# Altium project DAN_RF_ESP.PrjPcb
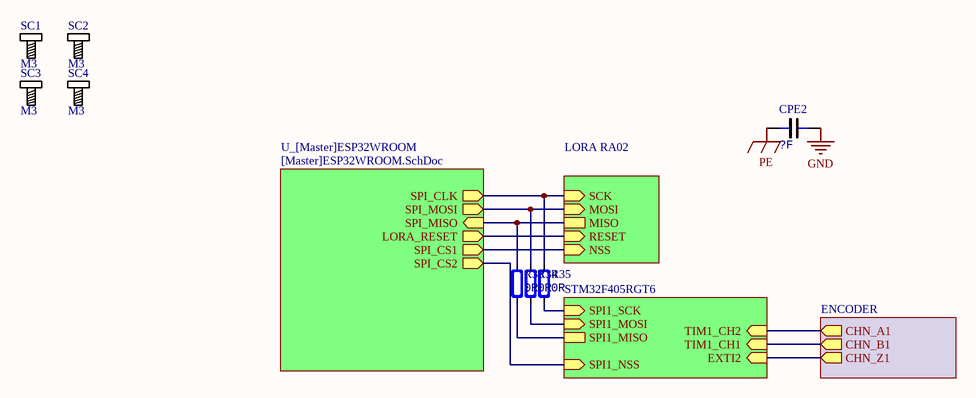
[diagram p0: TOPLEVEL.SchDoc]
5 sheets, 89 parts. Net scope: hierarchical (ports join the sheet entries above them; power ports are global).
Board file: DAN_ENCODER.PcbDoc
Sheets:
  TOPLEVEL.SchDoc
    U_[Master]ESP32WROOM = [Master]ESP32WROOM.SchDoc
    LORA RA02 = [Slave]SX1278.SchDoc
    STM32F405RGT6 = [Slave]STM32F405RGT6.SchDoc
    ENCODER = [Module]ReadSingleEncoderABZ.SchDoc

## Sheet TOPLEVEL.SchDoc: AC
size A4; Author: Nguyen Huu Nghia; CompanyName: MAT; Organization: AD20; Address1: x; Address2: x; Address3: x; Address4: x; DocumentNumber: 1; Revision: V1.0; SheetNumber: 1; SheetTotal: 1

### Parts
CPE2  value ?F  [CN3]  (hidden comment: Cap_PE)
R33  value 0R  [RES-1/4W]  (hidden comment: Resistor)
R34  value 0R  [RES-1/4W]  (hidden comment: Resistor)
R35  value 0R  [RES-1/4W]  (hidden comment: Resistor)
SC1  M3  [SCRREW_M3]
SC2  M3  [SCRREW_M3]
SC3  M3  [SCRREW_M3]
SC4  M3  [SCRREW_M3]

### Sub-sheets
ENCODER = [Module]ReadSingleEncoderABZ.SchDoc: CHN_A1 (out), CHN_B1 (out), CHN_Z1 (out)
LORA RA02 = [Slave]SX1278.SchDoc: NSS (in), SCK (in), MOSI (in), RESET (in), MISO
STM32F405RGT6 = [Slave]STM32F405RGT6.SchDoc: TIM1_CH2 (in), TIM1_CH1 (in), EXTI2 (in), SPI1_NSS (in), SPI1_SCK (in), SPI1_MOSI (in), SPI1_MISO
U_[Master]ESP32WROOM = [Master]ESP32WROOM.SchDoc: LORA_RESET (out), SPI_MOSI (out), SPI_CLK (out), SPI_MISO (in), SPI_CS2 (out), SPI_CS1 (out)

### Nets
GND: CPE2.2
PE: CPE2.1
CHN_A1: sheet STM32F405RGT6/TIM1_CH2, sheet ENCODER/CHN_A1
CHN_B1: sheet STM32F405RGT6/TIM1_CH1, sheet ENCODER/CHN_B1
CHN_Z1: sheet STM32F405RGT6/EXTI2, sheet ENCODER/CHN_Z1
LORA_RESET: sheet U_[Master]ESP32WROOM/LORA_RESET, sheet LORA RA02/RESET
MISO: R33.2 ; sheet U_[Master]ESP32WROOM/SPI_MISO, sheet LORA RA02/MISO
MOSI: R34.2 ; sheet U_[Master]ESP32WROOM/SPI_MOSI, sheet LORA RA02/MOSI
NSS: sheet U_[Master]ESP32WROOM/SPI_CS1, sheet LORA RA02/NSS
SCK: R35.2 ; sheet U_[Master]ESP32WROOM/SPI_CLK, sheet LORA RA02/SCK
SPI1_MISO: R33.1 ; sheet STM32F405RGT6/SPI1_MISO
SPI1_MOSI: R34.1 ; sheet STM32F405RGT6/SPI1_MOSI
SPI1_NSS: sheet U_[Master]ESP32WROOM/SPI_CS2, sheet STM32F405RGT6/SPI1_NSS
SPI1_SCK: R35.1 ; sheet STM32F405RGT6/SPI1_SCK

### Notes on the sheet
- Title
- Size:
- Date:
- A4
- Number:
- Time:
- Revision:
- Sheet
- of
- File:

### Library data of the parts
CPE2 = Cap_PE: Capacitor; Manufacturer: *; Note: *
R33-R35 = Resistor: SMD Resistor; Specification: ±1%; Manufacturer: *; Note: *
SC1-SC4 = Screw_M3: Screw

## Sheet [Master]ESP32WROOM.SchDoc: AC
size A4; Author: Nguyen Huu Nghia; CompanyName: MAT; Organization: AD20; Address1: x; Address2: x; Address3: x; Address4: x; DocumentNumber: 1; Revision: V1.0; SheetNumber: 1; SheetTotal: 1
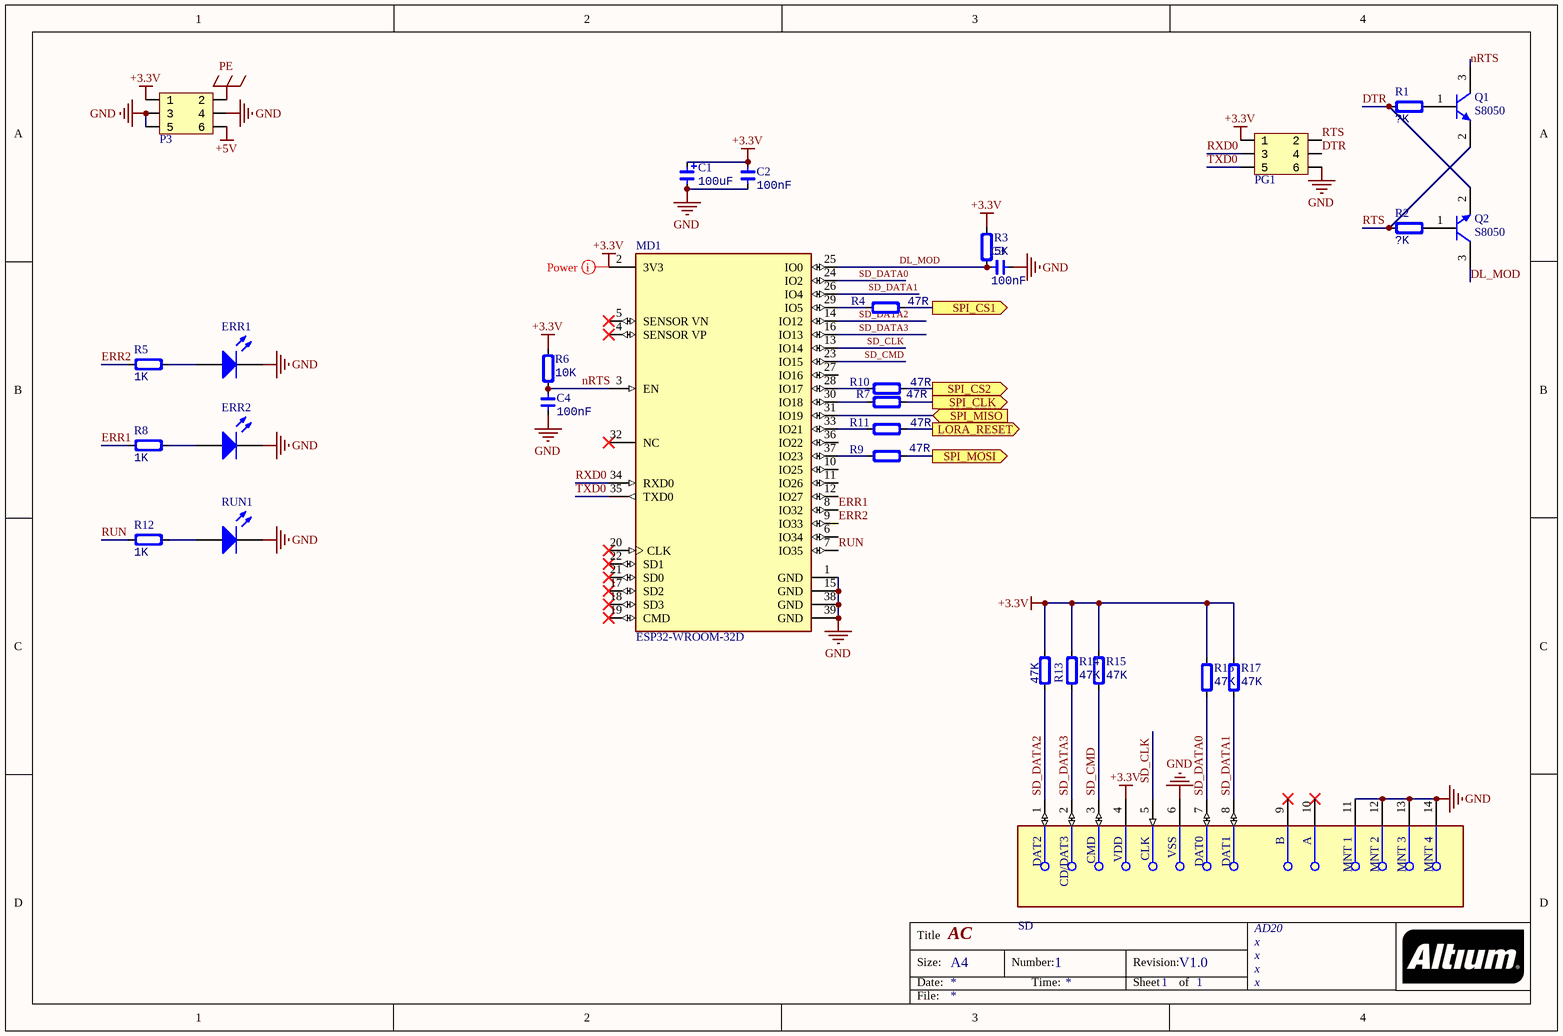
[diagram p1: [Master]ESP32WROOM.SchDoc]

### Parts
C1  value 100uF  [CAP_TAN_1206]  (hidden comment: C1206)
C2  value 100nF  [CAP-0805]  (hidden comment: Cap_0805)
C3  value 100nF  [CAP-0603]  (hidden comment: Cap_0603)
C4  value 100nF  [CAP-0603]  (hidden comment: Cap_0603)
ERR1  150080YS75000  [0805_A]  (value not drawn)
ERR2  150080YS75000  [0805_A]  (value not drawn)
MD1  ESP32-WROOM-32D  [FP-ESP32-WROOM-32D-MFG]
P3  HDR2x3  [HDR2X3_2.54_90F]  (value not drawn)
PG1  HDR2x3  [HDR2X3_2.54_90F]  (value not drawn)
Q1  S8050  [ONSC-SOT-23-3-318-08_V]
Q2  S8050  [ONSC-SOT-23-3-318-08_V]
R1  value ?K  [RES-0805]  (hidden comment: R0805)
R2  value ?K  [RES-0805]  (hidden comment: R0805)
R3  value 5K  [RES-0805]  (hidden comment: R0805)
R4  value 47R  [RES-0805]  (hidden comment: R0805)
R5  value 1K  [RES-0805]  (hidden comment: R0805)
R6  value 10K  [RES-0805]  (hidden comment: R0805)
R7  value 47R  [RES-0805]  (hidden comment: R0805)
R8  value 1K  [RES-0805]  (hidden comment: R0805)
R9  value 47R  [RES-0805]  (hidden comment: R0805)
R10  value 47R  [RES-0805]  (hidden comment: R0805)
R11  value 47R  [RES-0805]  (hidden comment: R0805)
R12  value 1K  [RES-0805]  (hidden comment: R0805)
R13  value 47K  [RES-0805]  (hidden comment: R0805)
R14  value 47K  [RES-0805]  (hidden comment: R0805)
R15  value 47K  [RES-0805]  (hidden comment: R0805)
R16  value 47K  [RES-0805]  (hidden comment: R0805)
R17  value 47K  [RES-0805]  (hidden comment: R0805)
RUN1  150080YS75000  [0805_A]  (value not drawn)
SD  DM3AT-SF-PEJM5(11)  [FP-DM3AT-SF-PEJM5_11-MFG]  (value not drawn)

### Ports
LORA_RESET (out), SPI_CLK (out), SPI_CS1 (out), SPI_CS2 (out), SPI_MISO (in), SPI_MOSI (out)

### Nets
+3.3V: C1.1 C2.2 MD1.2(3V3) P3.1 PG1.1 R3.1 R6.1 R13.1 R14.1 R15.1 R16.1 R17.1 SD.4(VDD)
+5V: P3.6
GND: C1.2 C2.1 C3.1 C4.1 ERR1.1(K) ERR2.1(K) MD1.1(GND) MD1.15(GND) MD1.38(GND) MD1.39(GND) P3.3 P3.4 P3.5 PG1.6 RUN1.1(K) SD.6(VSS) SD.11(MNT_1) SD.12(MNT_2) SD.13(MNT_3) SD.14(MNT_4)
PE: P3.2
DL_MOD: C3.2 MD1.25(IO0) Q2.3(C) R3.2
DTR: PG1.4 Q2.2(E) R1.1
ERR1: MD1.8(IO32) R8.2
ERR2: MD1.9(IO33) R5.2
LORA_RESET: R11.2 ; port LORA_RESET
MISO: MD1.31(IO19) ; port SPI_MISO
MOSI: R9.2 ; port SPI_MOSI
nRTS: C4.2 MD1.3(EN) Q1.3(C) R6.2
NSS: R4.2 ; port SPI_CS1
RTS: PG1.2 Q1.2(E) R2.1
RUN: MD1.7(IO35) R12.2
RXD0: MD1.34(RXD0) PG1.3
SCK: R7.2 ; port SPI_CLK
SD_CLK: MD1.13(IO14) SD.5(CLK)
SD_CMD: MD1.23(IO15) R15.2 SD.3(CMD)
SD_DATA0: MD1.24(IO2) R16.2 SD.7(DAT0)
SD_DATA1: MD1.26(IO4) R17.2 SD.8(DAT1)
SD_DATA2: MD1.14(IO12) R13.2 SD.1(DAT2)
SD_DATA3: MD1.16(IO13) R14.2 SD.2(CD/DAT3)
SPI1_NSS: R10.2 ; port SPI_CS2
TXD0: MD1.35(TXD0) PG1.5
NetERR1_2: ERR1.2(A) R5.1
NetERR2_2: ERR2.2(A) R8.1
NetMD1_28: MD1.28(IO17) R10.1
NetMD1_29: MD1.29(IO5) R4.1
NetMD1_30: MD1.30(IO18) R7.1
NetMD1_33: MD1.33(IO21) R11.1
NetMD1_37: MD1.37(IO23) R9.1
NetQ1_1: Q1.1(B) R1.2
NetQ2_1: Q2.1(B) R2.2
NetR12_1: R12.1 RUN1.2(A)

Not connected (* = marked no-connect by the designer): MD1 4(SENSOR_VP)* 5(SENSOR_VN)* 6(IO34) 10(IO25) 11(IO26) 12(IO27) 17(SD2)* 18(SD3)* 19(CMD)* 20(CLK)* 21(SD0)* 22(SD1)* 27(IO16) 32(NC)* 36(IO22); SD 9(B)* 10(A)*

### Layout directives
mark named Power: +3.3V

### Notes on the sheet
- Title
- Size:
- Date:
- A4
- Number:
- Time:
- Revision:
- Sheet
- of
- File:

### Library data of the parts
C1 = Cap_Tan_1206: Capacitor Tantalum; Manufacturer: *; Note: *
C2 = Cap_0805: Capacitor; Manufacturer: *
C3 C4 = Cap_0603: Capacitor; Manufacturer: *
ERR1 ERR2 RUN1 = CMP-1426-00012-1: SMD mono-color Chip LED, WL-SMCW, Yellow; Manufacturer: Wuerth Elektronik; Color: Yellow; ComponentLink1URL: http://www.we-online.com; PackageReference: 0805_A; ComponentLink2URL: http://katalog.we-online.com/led/datasheet/150080YS75000.pdf; ComponentLink1Description: Manufacturer URL; ComponentLink2Description: Datasheet; PartNumber: 150080YS75000
MD1 = CMP-194065-000003-1: WIFI MODULE 32MBITS SPI FLASH; Manufacturer: Espressif Systems; Max Supply Voltage: 3.6V; Nominal Supply Current: 500mA; Max Frequency: 2484MHz; Number Of Adc Channels: 16; Number Of Gpio: 32; Interface: I2C,SPI,UART,Ethernet,I2S,Other; Data Rate: 150Mbits/s; Min Supply Voltage: 3V; Bandwidth: 72MHz; Sensitivity: -98dBm; Octopart: https://octopart.com/esp32-wroom-32d-espressif+systems-91040050; Package: ESP32-WROOM-32D; ComponentLink2URL: https://www.espressif.com/sites/default/files/documentation/esp32-wroom-32d_esp32-wroom-32u_datasheet_en.pdf; Lead Free: Yes; Category: UNK; Mouser Description: Wi-Fi/BT BLE Module ESP32-D0WD, SPI Flash, UART, P; Device Class L1: Integrated Circuits (ICs); RoHS: TRUE; Temperature Range Low: -40°C; ComponentLink2Description: Datasheet; Digikey Description: WIFI MODULE 32MBITS SPI FLASH; Height: 3.2mm; Temperature: -40°C to +85°C; Manufacturer Part Number: ESP32-WROOM-32D; Device Class L3: Transceivers; Device Class L2: RF Semiconductors and Devices; Temperature Range High: +85°C; Automotive: No
P3 PG1 = HDR2x3_2.54: Header
Q1 Q2 = CMP-1048-00662-1: High Voltage Transistor, NPN Silicon, 3-Pin SOT-23, Pb-Free, Tape and Reel; PartNumber: MMBTA42LT1G; Manufacturer: On Semiconductor; fT Min (MHz): 50; IC Continuous (A): 0.5; ComponentLink1URL: http://www.onsemi.com/; ComponentLink3URL: http://www.onsemi.cn/pub_link/Collateral/318-08.PDF; RoHS: TRUE; ComponentLink2Description: Datasheet; Polarity: NPN; DatasheetVersion: Rev. 12; PackageReference: SOT-23-3-318-08; PackageDescription: 3-Pin Small Outline Transistor, Body 2.92 x 1.3 mm, Pitch 0.95 mm; ComponentLink3Description: Package Specification; ComponentLink1Description: Manufacturer URL; Packing: Tape and Reel; PackageVersion: Rev. AP, 11/2009; Mounting Technology: Surface Mount; ComponentLink2URL: http://www.onsemi.cn/pub_link/Collateral/MMBTA42LT1-D.PDF
R1-R17 = Res_0805: Resistor; Manufacturer: *
SD = MicroSDCARD: CONN MICRO SD R/A PUSH-PUSH SMD; Manufacturer: Hirose; Number Of Contacts: 8; Current Rating: 0.5A; Shielding: true; Conn Orientation: Right Angle; Voltage Rating: 125V; Is Female: yes; Pitch: 1.1mm; Footprint Url: https://www.hirose.com/product/document?clcode=CL0609-0031-0-00&productname=DM3AT-SF-PEJM5&series=DM3&documenttype=2DDrawing&lang=en&documentid=0000947170; Temperature: -25°C to +85°C; Device Class L2: Memory Connectors; Device Class L1: Connectors; Device Class L3: unset; Temperature Range High: +85°C; Package: 0; Contact Material: Gold; Automotive: No; Mouser Description: Memory Card Connectors 8P R/A SMT MICRO SD PUSH-PUSH; Category: Conn; ComponentLink2URL: https://www.hirose.com/product/document?clcode=CL0609-0033-6-00&productname=DM3AT-SF-PEJ2M5&series=DM3&documenttype=Catalog&lang=en&documentid=D49662_en; Temperature Range Low: -25°C; RoHS: TRUE; ComponentLink2Description: Datasheet; Manufacturer Part Number: DM3AT-SF-PEJM5(11); Height: 1.83mm; Digikey Description: CONN MICRO SD R/A PUSH-PUSH SMD; Lead Free: Yes; Octopart: https://octopart.com/dm3at-sf-pejm5%2811%29-hirose-29719365

## Sheet [Slave]SX1278.SchDoc: AC
size A4; Author: Nguyen Huu Nghia; CompanyName: MAT; Organization: AD20; Address1: x; Address2: x; Address3: x; Address4: x; DocumentNumber: 1; Revision: V1.0; SheetNumber: 1; SheetTotal: 1
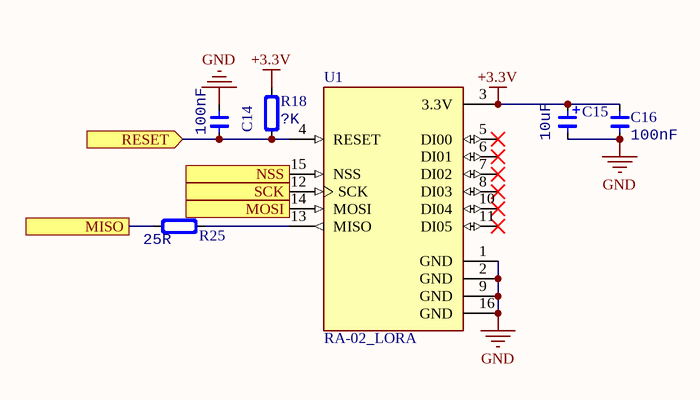
[diagram p2: [Slave]SX1278.SchDoc]

### Parts
C14  value 100nF  [CAP-0603]  (hidden comment: Cap_0603)
C15  value 10uF  [CAP_TAN_1206]  (hidden comment: C1206)
C16  value 100nF  [CAP-0603]  (hidden comment: Cap_0603)
R18  value ?K  [RES-0805]  (hidden comment: R0805)
R25  value 25R  [RES-0805]  (hidden comment: Res_0805)
U1  RA-02_LORA  [MODULE_RA-02_LORA]

### Ports
MISO, MOSI (in), NSS (in), RESET (in), SCK (in)

### Nets
+3.3V: C15.1 C16.2 R18.2 U1.3(3.3V)
GND: C14.1 C15.2 C16.1 U1.1(GND) U1.2(GND) U1.9(GND) U1.16(GND)
LORA_RESET: C14.2 R18.1 U1.4(RESET) ; port RESET
MISO: R25.1 ; port MISO
MOSI: U1.14(MOSI) ; port MOSI
NSS: U1.15(NSS) ; port NSS
SCK: U1.12(SCK) ; port SCK
NetR25_2: R25.2 U1.13(MISO)

Not connected (* = marked no-connect by the designer): U1 5(DI00)* 6(DI01)* 7(DI02)* 8(DI03)* 10(DI04)* 11(DI05)*

### Notes on the sheet
- Title
- Size:
- Date:
- A4
- Number:
- Time:
- Revision:
- Sheet
- of
- File:

### Library data of the parts
C14 C16 = Cap_0603: Capacitor; Manufacturer: *; Note: *
C15 = Cap_Tan_1206: Capacitor Tantalum; Manufacturer: *; Note: *
R18 = Res_0805: Resistor; Manufacturer: *; Note: *
R25 = Res_0805: Resistor; Specification: ±1%; Manufacturer: *; Note: *
U1 = RA-02_LORA: Ra-02 LoRa RF M5Stack Platform Evaluation Expansion Board; MF: AI-Thinker; Package: Package; Availability: Unavailable; Value: *; MP: Ra-02 LoRa; Check_prices: https://www.snapeda.com/parts/Ra-02%20LoRa/AI-Thinker/view-part/4449259/?ref=eda; SnapEDA_Link: https://www.snapeda.com/parts/Ra-02%20LoRa/AI-Thinker/view-part/4449259/?ref=snap; Price: None

## Sheet [Slave]STM32F405RGT6.SchDoc: AC
size A4; Author: Nguyen Huu Nghia; CompanyName: MAT; Organization: AD20; Address1: x; Address2: x; Address3: x; Address4: x; DocumentNumber: 1; Revision: V1.0; SheetNumber: 1; SheetTotal: 1
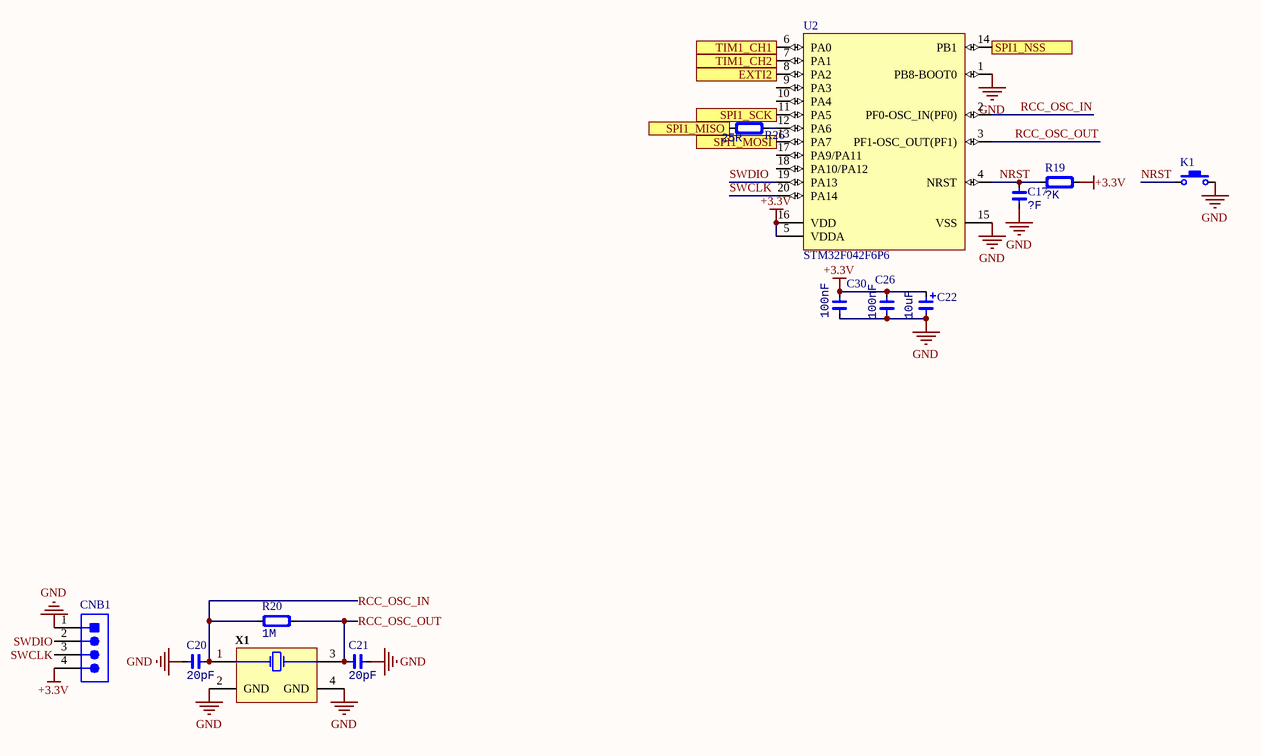
[diagram p3: [Slave]STM32F405RGT6.SchDoc]

### Parts
C17  value ?F  [CAP-0603]  (hidden comment: Cap_0603)
C20  value 20pF  [CAP-0603]  (hidden comment: Cap_0603)
C21  value 20pF  [CAP-0603]  (hidden comment: Cap_0603)
C22  value 10uF  [CAP_TAN_1206]  (hidden comment: C1206)
C26  value 100nF  [CAP-0603]  (hidden comment: Cap_0603)
C30  value 100nF  [CAP-0603]  (hidden comment: Cap_0603)
CNB1  B4B-EH-A(LF)(SN)  [JST-B4B-EH-A_V]  (value not drawn)
K1  TACT  [ButtonTACT_3x4x2_180]  (value not drawn)
R19  value ?K  [RES-0603]  (hidden comment: R0603)
R20  value 1M  [RES-0603]  (hidden comment: Res_0603)
R26  value 25R  [RES-0805]  (hidden comment: Res_0805)
U2  STM32F042F6P6  [STM-TSSOP20_M]
X1  7B-12.288MAAJ-T  [TXC-7B-4_V]  (value not drawn)

### Ports
EXTI2 (in), SPI1_MISO, SPI1_MOSI (in), SPI1_NSS (in), SPI1_SCK (in), TIM1_CH1 (in), TIM1_CH2 (in)

### Nets
+3.3V: C22.1 C26.2 C30.2 CNB1.4 R19.2 U2.5(VDDA) U2.16(VDD)
GND: C17.1 C20.2 C21.1 C22.2 C26.1 C30.1 CNB1.1 K1.2 U2.1(PB8-BOOT0) U2.15(VSS) X1.2(GND) X1.4(GND)
CHN_A1: U2.7(PA1) ; port TIM1_CH2
CHN_B1: U2.6(PA0) ; port TIM1_CH1
CHN_Z1: U2.8(PA2) ; port EXTI2
NRST: C17.2 K1.1 R19.1 U2.4(NRST)
RCC_OSC_IN: C20.1 R20.1 U2.2(PF0-OSC_IN(PF0)) X1.1(X1)
RCC_OSC_OUT: C21.2 R20.2 U2.3(PF1-OSC_OUT(PF1)) X1.3(X2)
SPI1_MISO: R26.1 ; port SPI1_MISO
SPI1_MOSI: U2.13(PA7) ; port SPI1_MOSI
SPI1_NSS: U2.14(PB1) ; port SPI1_NSS
SPI1_SCK: U2.11(PA5) ; port SPI1_SCK
SWCLK: CNB1.3 U2.20(PA14)
SWDIO: CNB1.2 U2.19(PA13)
NetR26_2: R26.2 U2.12(PA6)

Not connected (* = marked no-connect by the designer): U2 9(PA3) 10(PA4) 17(PA9/PA11) 18(PA10/PA12)

### Notes on the sheet
- Title
- Size:
- Date:
- A4
- Number:
- Time:
- Revision:
- Sheet
- of
- File:

### Library data of the parts
C17 C20 C21 C26 C30 = Cap_0603: Capacitor; Manufacturer: *
  C17 C26 C30: Note: *
C22 = Cap_Tan_1206: Capacitor Tantalum; Manufacturer: *; Note: *
CNB1 = CMP-2000-05904-1: Male Header, Pitch 2.5 mm, 1 x 4 Position, Height 6 mm, Tail Length 3.2 mm, -25 to 85 degC, RoHS, Bulk; Manufacturer: JST; Style/Orientation: StraightHeader/Plug; Pitch: 2.5mm; No of Positions: 4; Mounting Technology: SurfaceMount; Package Description: Male Header, Pitch 2.5 mm, 1 x 4 Position, Height 6 mm, Tail Length 3.2 mm; Datasheet Version: 12/2012; Type: ShroudedHeader; Package Reference: B4B-EH-A; Manufacturer URL: http://www.jst.com/home2.html; Termination: Crimp; Datasheet URL: http://www.jst-mfg.com/product/pdf/eng/eEH.pdf
K1 = ButtonTACT_180_3x4x2: Button; value: 3x4mm; type: TACT 2P
R19 = Res_0603: Resistor; Manufacturer: *; Note: *
R20 = Res_0603: Resistor; Specification: ±1%; Manufacturer: *; Note: *
R26 = Res_0805: Resistor; Specification: ±1%; Manufacturer: *; Note: *
U2 = CMP-0304-00108-2: ARM Cortex-M0 32-bit MCU, 32 KB Flash, 6 KB Internal RAM, 16 I/Os, 20-Pin TSSOP, -40 to 85 degC, Tube; Manufacturer: STMicroelectronics; Package Description: 20-Pin Thin Shrink Small Outline Package, Body 6.5 x 4.4 mm, Pitch 0.65 mm; ComponentLink1URL: http://www.st.com/; ComponentLink2Description: Datasheet; Package Reference: TSSOP20; ComponentLink2URL: http://www.st.com/st-web-ui/static/active/en/resource/technical/document/datasheet/DM00105814.pdf; ComponentLink1Description: Manufacturer URL; Mounting Technology: Surface Mount; Core: ARM Cortex-M0; PartNumber: STM32F042F6P6; DatasheetVersion: Rev. 5
X1 = CMP-1774-00006-1: SMD Seam Sealing Crystal, 12.288 MHz, +/- 30 ppm, 18 pF, -10 to 70 degC, 4-Pin SMD, RoHS, Tape and Reel; Forward Current: 200 mA; Peak Reverse Current: 2 uA; Max Surge Current: 600 mA; Case\Package: SOT-23; Elements: 2; Recovery Time: 5 ns; Forward Voltage: 800 mV; Mount: Surface Mount; Min Operating Temperature: -55 degC; Height: 0.93 mm; RoHSCompliant: true; PackageDescription: 4-Pin Surface Mount Device, Body 5 x 3.2 mm, Pitch 3.7 mm; ComponentLink1Description: Datasheet; REACH SVHC: No SVHC; Packaging: Tape and Reel; ComponentLink1URL: http://www.txccorp.com/download/products/quartz_crystals/2015TXC_7B_19.pdf; Pins: 3; Width: 1.3 mm; DatasheetVersion: Jul-15; Max Operating Temperature: 150 degC; Radiation Hardening: No; Package Quantity: 3000; PackageReference: 7B-4; Length: 2.92 mm

## Sheet [Module]ReadSingleEncoderABZ.SchDoc: AC
size A4; Author: Nguyen Huu Nghia; CompanyName: MAT; Organization: AD20; Address1: x; Address2: x; Address3: x; Address4: x; DocumentNumber: 1; Revision: V1.0; SheetNumber: 1; SheetTotal: 1
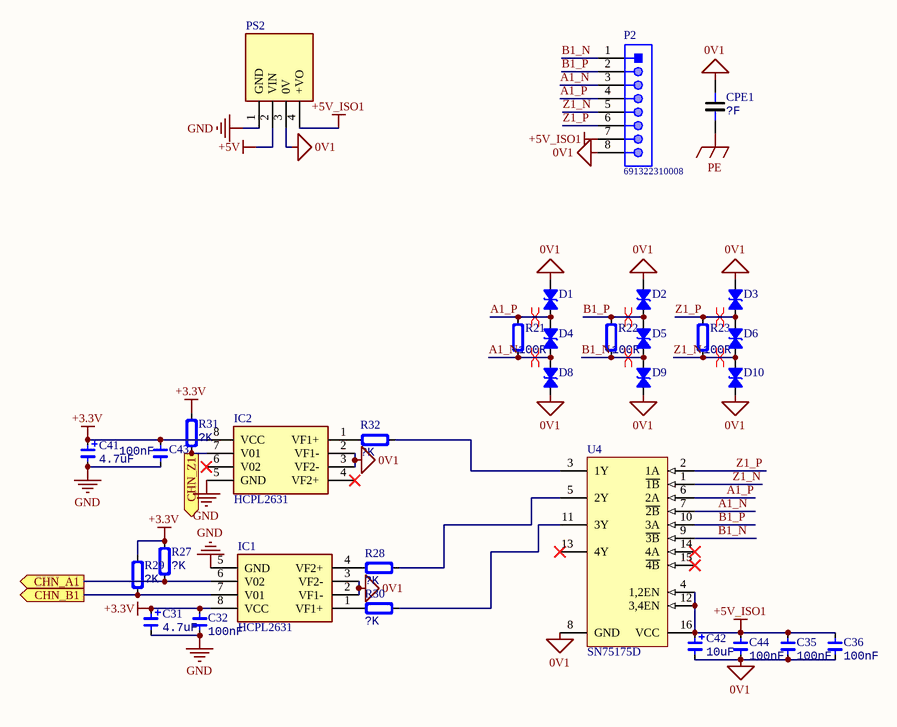
[diagram p4: [Module]ReadSingleEncoderABZ.SchDoc]

### Parts
C31  value 4.7uF  [CAP_TAN_1206]  (hidden comment: C1206)
C32  value 100nF  [CAP-0805]  (hidden comment: Cap_0805)
C35  value 100nF  [CAP-0603]  (hidden comment: Cap_0603)
C36  value 100nF  [CAP-0603]  (hidden comment: Cap_0603)
C41  value 4.7uF  [CAP_TAN_1206]  (hidden comment: C1206)
C42  value 10uF  [CAP_TAN_1206]  (hidden comment: C1206)
C43  value 100nF  [CAP-0805]  (hidden comment: Cap_0805)
C44  value 100nF  [CAP-0603]  (hidden comment: Cap_0603)
CPE1  value ?F  [CN3]  (hidden comment: Cap_PE)
D1  SOD323  [SOD-323]  (value not drawn)
D2  SOD323  [SOD-323]  (value not drawn)
D3  SOD323  [SOD-323]  (value not drawn)
D4  SOD323  [SOD-323]  (value not drawn)
D5  SOD323  [SOD-323]  (value not drawn)
D6  SOD323  [SOD-323]  (value not drawn)
D8  SOD323  [SOD-323]  (value not drawn)
D9  SOD323  [SOD-323]  (value not drawn)
D10  SOD323  [SOD-323]  (value not drawn)
IC1  HCPL2631  [DIP762W56P254L966H508Q8N]
IC2  HCPL2631  [DIP762W56P254L966H508Q8N]
P2  691322310008  [691322310008]
PS2  B2405S-1WR2  [B2405S1WR2]  (value not drawn)
R21  value 100R  [RES-1206]  (hidden comment: Res_1206)
R22  value 100R  [RES-1206]  (hidden comment: Res_1206)
R23  value 100R  [RES-1206]  (hidden comment: Res_1206)
R27  value ?K  [RES-0805]  (hidden comment: Res_0805)
R28  value ?K  [RES-0805]  (hidden comment: Res_0805)
R29  value ?K  [RES-0805]  (hidden comment: Res_0805)
R30  value ?K  [RES-0805]  (hidden comment: Res_0805)
R31  value ?K  [RES-0805]  (hidden comment: Res_0805)
R32  value ?K  [RES-0805]  (hidden comment: Res_0805)
U4  SN75175D  [D0016A_M]

### Ports
CHN_A1 (out), CHN_B1 (out), CHN_Z1 (out)

### Nets
0V1: C35.1 C36.1 C42.2 C44.1 CPE1.2 D1.2(K) D2.2(K) D3.2(K) D8.1(A) D9.1(A) D10.1(A) IC1.2(VF1-) IC1.3(VF2-) IC2.2(VF1-) IC2.3(VF2-) P2.8 PS2.3(0V) U4.8(GND)
+3.3V: C31.1 C32.2 C41.1 C43.2 IC1.8(VCC) IC2.8(VCC) R27.2 R29.2 R31.2
+5V: PS2.2(VIN)
+5V_ISO1: C35.2 C36.2 C42.1 C44.2 P2.7 PS2.4(+VO) U4.4(1,2EN) U4.12(3,4EN) U4.16(VCC)
GND: C31.2 C32.1 C41.2 C43.1 IC1.5(GND) IC2.5(GND) PS2.1(GND)
PE: CPE1.1
A1_N: D4.1(A) D8.2(K) P2.3 R21.1 U4.7(~{2B})
A1_P: D1.1(A) D4.2(K) P2.4 R21.2 U4.6(2A)
B1_N: D5.1(A) D9.2(K) P2.1 R22.1 U4.9(~{3B})
B1_P: D2.1(A) D5.2(K) P2.2 R22.2 U4.10(3A)
CHN_A1: IC1.6(V02) R27.1 ; port CHN_A1
CHN_B1: IC1.7(V01) R29.1 ; port CHN_B1
CHN_Z1: IC2.7(V01) R31.1 ; port CHN_Z1
Z1_N: D6.1(A) D10.2(K) P2.5 R23.1 U4.1(~{1B})
Z1_P: D3.1(A) D6.2(K) P2.6 R23.2 U4.2(1A)
NetIC1_1: IC1.1(VF1+) R30.2
NetIC1_4: IC1.4(VF2+) R28.2
NetIC2_1: IC2.1(VF1+) R32.2
NetR28_1: R28.1 U4.5(2Y)
NetR30_1: R30.1 U4.11(3Y)
NetR32_1: R32.1 U4.3(1Y)

Not connected (* = marked no-connect by the designer): IC2 4(VF2+)* 6(V02)*; U4 13(4Y)* 14(4A)* 15(~{4B})*

### Layout directives
differential pair: A1_N, A1_P, B1_N, B1_P, Z1_N, Z1_P

### Notes on the sheet
- Title
- Size:
- Date:
- A4
- Number:
- Time:
- Revision:
- Sheet
- of
- File:

### Library data of the parts
C31 C41 C42 = Cap_Tan_1206: Capacitor Tantalum; Manufacturer: *
  C42: Note: *
C32 C43 = Cap_0805: Capacitor; Manufacturer: *
C35 C36 C44 = Cap_0603: Capacitor; Manufacturer: *; Note: *
CPE1 = Cap_PE: Capacitor; Manufacturer: *
D1-D6 D8-D10 = Diode_TVS: TVS Diode; Manufacturer: *; Specification: *; Note: *; Value: SOD323
IC1 IC2 = HCPL2631: Integrated Circuit; Manufacturer_Name: ON Semiconductor; Datasheet Link: https://www.onsemi.com/pub/Collateral/HCPL2631-D.PDF; Height: 5.08mm; Manufacturer_Part_Number: HCPL2631; Mouser Part Number: 512-HCPL-2631; Mouser Price/Stock: https://www.mouser.co.uk/ProductDetail/ON-Semiconductor-Fairchild/HCPL2631?qs=WgFN8SqQKV0cGSFMLUo%252BuQ%3D%3D; Arrow Part Number: HCPL2631; Arrow Price/Stock: https://www.arrow.com/en/products/hcpl2631/on-semiconductor
P2 = CMP-1502-01892-1: Serie 322 - 3.81mm Horizontal PCB Header WR-TBL, 8 pin; Manufacturer: Wurth Elektronik; Pin Number: 8; Gender: Male; Operating Temperature: -40to105degC; Mounting Technology: THT; Manufacturer URL: http://www.we-online.de; Package Reference: 691322310008; Packaging: Box; Part Number: 691322310008; Publisher: WurthElektronik; Datasheet URL: http://katalog.we-online.de/em/datasheet/6913223100xx.pdf; Pitch: 3.81mm
PS2 = B2405S-1WR2: Power Supply; Manufacturer_Name: Mornsun; Datasheet Link: https://www.mornsun-power.com/uploads/pdf/B_S-1WR2.pdf; Height: 10.16mm; Manufacturer_Part_Number: B2405S-1WR2
R21-R23 = Res_1206: Resistor; Manufacturer: *
R27-R32 = Res_0805: Resistor; Specification: ±1%; Manufacturer: *; Note: *
U4 = CMP-0310-00152-2: Quadruple Differential Line Receiver, 0 TX / 4 RX, 5V, 0 to 70 degC, 16-Pin SOIC (D), Green (RoHS & no Sb/Br); Manufacturer: Texas Instruments; Supply Voltage(s)(V): 5; ESD(kV): 2; Receivers Per Package: 4; SubFamily: RS-422; Rating: Catalog; ICC(Max)(mA): 70; Footprint: MC3486; Code_JEDEC: MS-012AC; ComponentLink2Description: Package Specification; PackageDescription: 16-Pin Plastic Small Outline Integrated Circuit, 9.9 x 3.9 mm, Pitch 1.27 mm Pitch; # of TX/RX: 0 TX / 4 RX; ComponentLink2URL: http://www.ti.com/litv/pdf/mpds178g; ComponentLink1Description: Datasheet; PartNumber: SN75175D; PackageVersion: revM, Jun-2011; PackageReference: D0016A; ComponentLink1URL: http://www.ti.com/general/docs/lit/getliterature.tsp?genericPartNumber=SN75175&fileType=pdf; Eco-Plan: Green (RoHS & no Sb/Br); Mounting Technology: Surface Mount; Isolated: No; DatasheetVersion: SLLS145C

## Nets that join several sheets
+3.3V: [Master]ESP32WROOM (13 pins), [Slave]SX1278 (C15.1 C16.2 R18.2 U1.3), [Slave]STM32F405RGT6 (7 pins), [Module]ReadSingleEncoderABZ (9 pins)
+5V: [Master]ESP32WROOM (P3.6), [Module]ReadSingleEncoderABZ (PS2.2)
GND: TOPLEVEL (CPE2.2), [Master]ESP32WROOM (20 pins), [Slave]SX1278 (7 pins), [Slave]STM32F405RGT6 (12 pins), [Module]ReadSingleEncoderABZ (7 pins)
PE: TOPLEVEL (CPE2.1), [Master]ESP32WROOM (P3.2), [Module]ReadSingleEncoderABZ (CPE1.1)
CHN_A1: [Slave]STM32F405RGT6 (U2.7), [Module]ReadSingleEncoderABZ (IC1.6 R27.1)
CHN_B1: [Slave]STM32F405RGT6 (U2.6), [Module]ReadSingleEncoderABZ (IC1.7 R29.1)
CHN_Z1: [Slave]STM32F405RGT6 (U2.8), [Module]ReadSingleEncoderABZ (IC2.7 R31.1)
LORA_RESET: [Master]ESP32WROOM (R11.2), [Slave]SX1278 (C14.2 R18.1 U1.4)
MISO: TOPLEVEL (R33.2), [Master]ESP32WROOM (MD1.31), [Slave]SX1278 (R25.1)
MOSI: TOPLEVEL (R34.2), [Master]ESP32WROOM (R9.2), [Slave]SX1278 (U1.14)
NSS: [Master]ESP32WROOM (R4.2), [Slave]SX1278 (U1.15)
SCK: TOPLEVEL (R35.2), [Master]ESP32WROOM (R7.2), [Slave]SX1278 (U1.12)
SPI1_MISO: TOPLEVEL (R33.1), [Slave]STM32F405RGT6 (R26.1)
SPI1_MOSI: TOPLEVEL (R34.1), [Slave]STM32F405RGT6 (U2.13)
SPI1_NSS: [Master]ESP32WROOM (R10.2), [Slave]STM32F405RGT6 (U2.14)
SPI1_SCK: TOPLEVEL (R35.1), [Slave]STM32F405RGT6 (U2.11)